# EAGLE design hackerstacker_mainboard (EAGLE 6.4)
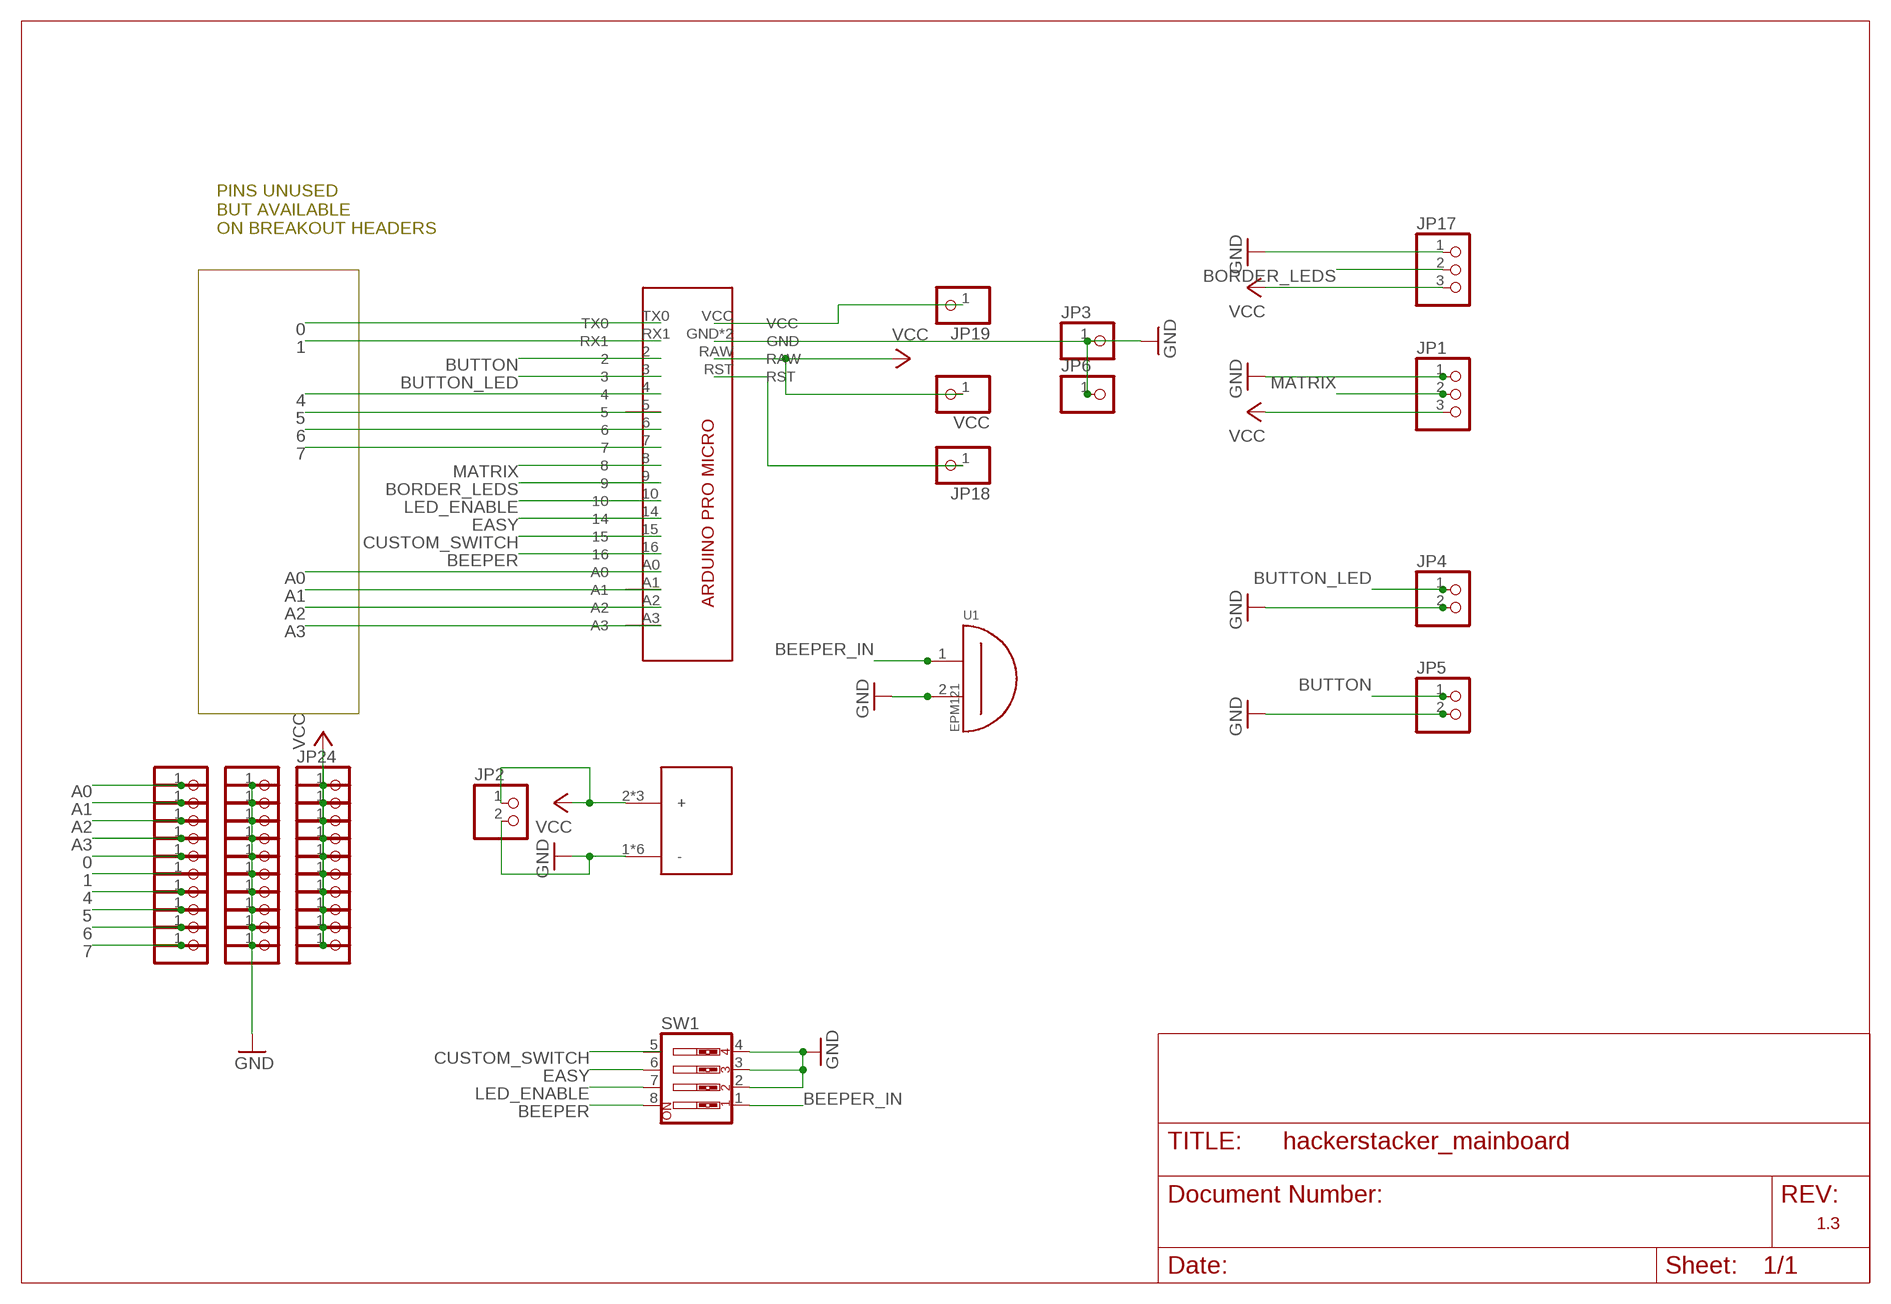
[diagram p0: schematic, sheet 1]

## Parts
JP1  PINHD-1X3  [1X03]
JP2  PINHD-1X2  [1X02]
JP3  PINHD-1X1CB  [1X01-CLEANBIG]
JP4  PINHD-1X2  [1X02]
JP5  PINHD-1X2  [1X02]
JP6  PINHD-1X1CB  [1X01-CLEANBIG]
JP7  PINHD-1X1CB  [1X01-CLEANBIG]
JP8  PINHD-1X1CB  [1X01-CLEANBIG]
JP9  PINHD-1X1CB  [1X01-CLEANBIG]
JP10  PINHD-1X1CB  [1X01-CLEANBIG]
JP11  PINHD-1X1CB  [1X01-CLEANBIG]
JP12  PINHD-1X1CB  [1X01-CLEANBIG]
JP13  PINHD-1X1CB  [1X01-CLEANBIG]
JP14  PINHD-1X1CB  [1X01-CLEANBIG]
JP15  PINHD-1X1CB  [1X01-CLEANBIG]
JP16  PINHD-1X1CB  [1X01-CLEANBIG]
JP17  PINHD-1X3  [1X03]
JP18  PINHD-1X1CB  [1X01-CLEANBIG]
JP19  PINHD-1X1CB  [1X01-CLEANBIG]
JP20  PINHD-1X1CB  [1X01-CLEANBIG]
JP21  PINHD-1X1CB  [1X01-CLEANBIG]
JP22  PINHD-1X1CB  [1X01-CLEANBIG]
JP23  PINHD-1X1CB  [1X01-CLEANBIG]
JP24  PINHD-1X1CB  [1X01-CLEANBIG]
JP25  PINHD-1X1CB  [1X01-CLEANBIG]
JP26  PINHD-1X1CB  [1X01-CLEANBIG]
JP27  PINHD-1X1CB  [1X01-CLEANBIG]
JP28  PINHD-1X1CB  [1X01-CLEANBIG]
JP29  PINHD-1X1CB  [1X01-CLEANBIG]
JP30  PINHD-1X1CB  [1X01-CLEANBIG]
JP31  PINHD-1X1CB  [1X01-CLEANBIG]
JP32  PINHD-1X1CB  [1X01-CLEANBIG]
JP33  PINHD-1X1CB  [1X01-CLEANBIG]
JP34  PINHD-1X1CB  [1X01-CLEANBIG]
JP35  PINHD-1X1CB  [1X01-CLEANBIG]
JP36  PINHD-1X1CB  [1X01-CLEANBIG]
JP37  PINHD-1X1CB  [1X01-CLEANBIG]
JP38  PINHD-1X1CB  [1X01-CLEANBIG]
JP39  PINHD-1X1CB  [1X01-CLEANBIG]
SW1  SW_DIP-4  [EDG-04]
U1  EPM121  [EPM121]
U$1  ARDUINO_PRO_MICRO  [APM_PAC]
U$3  2.1MMARDUINOPOERJACK  [POWERSUPPLY_DC-21MM]
VCC  PINHD-1X1CB  [1X01-CLEANBIG]

## Nets
0: JP11.1 U$1.TX0
1: JP12.1 U$1.RX1
4: JP13.1 U$1.4
5: JP37.1 U$1.5
6: JP38.1 U$1.6
7: JP39.1 U$1.7
A0: JP7.1 U$1.A0
A1: JP8.1 U$1.A1
A2: JP9.1 U$1.A2
A3: JP31.1 U$1.A3
BEEPER: SW1.8 U$1.16
BEEPER_IN: SW1.1 U1.1
BORDER_LEDS: JP17.2 U$1.9
BUTTON: JP5.1 U$1.2
BUTTON_LED: JP4.1 U$1.3
CUSTOM_SWITCH: SW1.5 U$1.15
EASY: SW1.6 U$1.14
GND: JP1.1 JP2.2 JP3.1 JP4.2 JP5.2 JP6.1 JP14.1 JP15.1 JP16.1 JP17.1 JP20.1 JP21.1 JP22.1 JP23.1 JP34.1 JP35.1 JP36.1 SW1.2 SW1.3 SW1.4 U1.2 U$1.GND U$1.GND2(GND) U$3.1(-) U$3.3(-) U$3.4(-) U$3.5(-) U$3.6(-) U$3.7(-)
LED_ENABLE: SW1.7 U$1.10
MATRIX: JP1.2 U$1.8
N$1: JP18.1 U$1.RST
N$15: JP19.1 U$1.VCC
VCC: JP1.3 JP2.1 JP10.1 JP17.3 JP24.1 JP25.1 JP26.1 JP27.1 JP28.1 JP29.1 JP30.1 JP32.1 JP33.1 U$1.RAW U$3.2(+) U$3.8(+) U$3.9(+) VCC.1

## Notes on the sheet
- PINS UNUSED 
  BUT AVAILABLE
  ON BREAKOUT HEADERS
- 1.3

## Library data of the parts
JP1 JP17 = pinhead:PINHD-1X3: PIN HEADER
JP2 JP4 JP5 = pinhead:PINHD-1X2: PIN HEADER
JP3 JP6-JP16 JP18-JP39 VCC = adafruit:PINHD-1X1: Pin header 1x1 for 0.1" spacing With round pins
SW1 = special:SW_DIP-4: DIP SWITCH
U1 = mp_modules:EPM121: EPM121 Piezo
U$1 = hackerstacker:ARDUINO_PRO_MICRO
U$3 = hackerstacker:2.1MMARDUINOPOERJACK

## Board
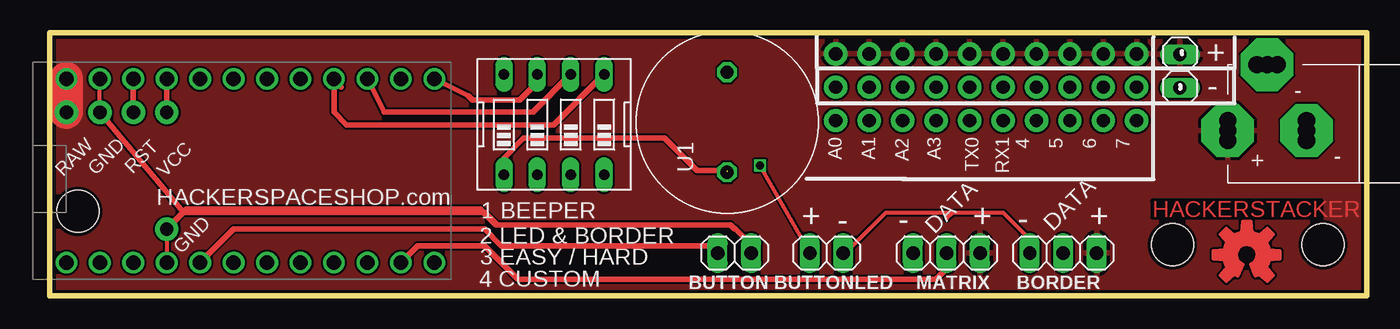
[diagram p1: board, top side]
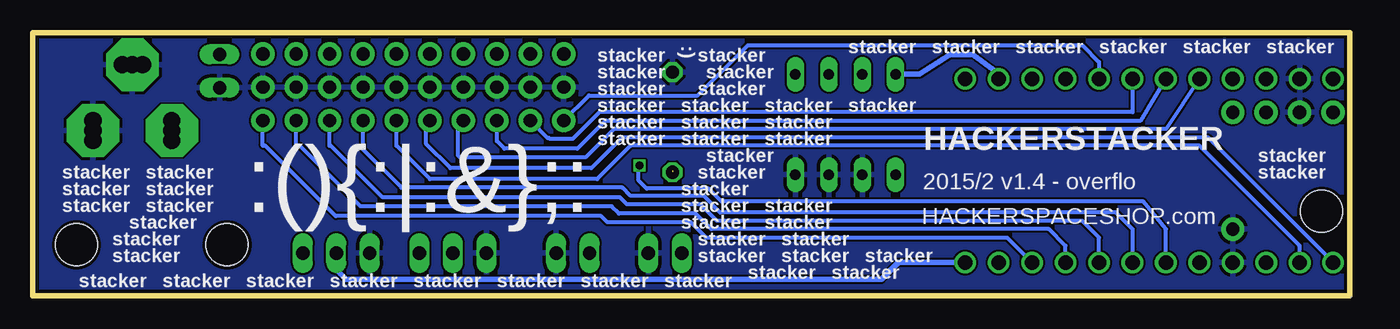
[diagram p2: board, bottom side, seen from below]

Size 100 x 20 mm. Coordinates in mm from the lower left corner, seen from the top.
Outline: 0,20 0,0 100,0 100,20 0,20
Copper layers (1*16): Top 0.035mm / dielectric 1.5mm / Bottom 0.035mm
Design rules "Fusion_eagle_rule_v1.1": minimum track width 6mil, minimum drill 12mil, track to track 6mil, track to pad 6mil, pad to pad 6mil, via to via 6mil, smd to smd 0mil, copper to edge 10mil, drill to drill 10mil, minimum pad ring 10mil, minimum via ring 6mil, stop-mask expansion 2mil, vias tented up to drill 100mil, thermal gap 10mil
Holes 3.2 mm at 96.69,3.89 2.14,6.43 85.26,3.89

### Footprints (pad centres in the part's own frame; a part is rotated, then mirrored left to right if it is on the bottom)
1X03 = drill 1.016 long: 1 -2.54,0; 2 0,0; 3 2.54,0
1X02 = drill 1.016 long: 1 -1.27,0; 2 1.27,0
1X01-CLEANBIG = drill 1.016 pad 1.778: 1 0,0
EDG-04 = drill 0.813 long: 1 -3.81,-3.81; 2 -1.27,-3.81; 3 1.27,-3.81; 4 3.81,-3.81; 5 3.81,3.81; 6 1.27,3.81; 7 -1.27,3.81; 8 -3.81,3.81
EPM121 = drill 1 octagon: 1 -3.8,0; 2 3.8,0
APM_PAC = drill 1.1: 2 -7.62,-1.27; 3 -7.62,-3.81; 4 -7.62,-6.35; 5 -7.62,-8.89; 6 -7.62,-11.43; 7 -7.62,-13.97; 8 -7.62,-16.51; 9 -7.62,-19.05; 10 6.35,-19.05; 14 6.35,-13.97; 15 6.35,-11.43; 16 6.35,-16.51; A0 6.35,-8.89; A1 6.35,-6.35; A2 6.35,-3.81; A3 6.35,-1.27; GND 6.35,6.35; GND2 -7.62,1.27; GNDRSTNC -7.62,3.81; RAW 6.35,8.89; RST 6.35,3.81; RX1 -7.62,6.35; TX0 -7.62,8.89; VCC 6.35,1.27
POWERSUPPLY_DC-21MM = drill 1.3 pad 4 octagon: 1 -5.08,-3.353; 2 -0.076,-6.35; 3 -0.076,-0.356 | drill 1.3: 4 -5.08,-4.115; 5 -5.08,-2.591; 6 -0.838,-0.356; 7 0.686,-0.356; 8 -0.838,-6.35; 9 0.686,-6.35

### Placement (x,y rotation side)
JP1  68.11,3.27 0 top
JP2  85.82,17.1 270 top
JP3  3.81,13.97 0 top
JP4  59,3.27 0 top
JP5  52,3.27 0 top
JP6  8.89,5.08 0 top
JP7  59.69,13.34 0 top
JP8  62.23,13.34 0 top
JP9  64.77,13.34 0 top
JP10  77.47,18.41 0 top
JP11  69.85,13.34 0 top
JP12  72.39,13.34 0 top
JP13  74.93,13.34 0 top
JP14  59.69,15.88 0 top
JP15  62.23,15.88 0 top
JP16  64.77,15.88 0 top
JP17  76.97,3.27 0 top
JP18  6.35,13.97 0 top
JP19  8.89,13.97 0 top
JP20  67.31,15.88 0 top
JP21  69.85,15.88 0 top
JP22  72.39,15.88 0 top
JP23  74.93,15.88 0 top
JP24  59.69,18.41 0 top
JP25  62.23,18.41 0 top
JP26  64.77,18.41 0 top
JP27  67.31,18.41 0 top
JP28  69.85,18.41 0 top
JP29  72.39,18.41 0 top
JP30  74.93,18.41 0 top
JP31  67.31,13.34 0 top
JP32  80.01,18.41 0 top
JP33  82.55,18.41 0 top
JP34  77.47,15.88 0 top
JP35  80.01,15.88 0 top
JP36  82.55,15.88 0 top
JP37  77.47,13.34 0 top
JP38  80.01,13.34 0 top
JP39  82.55,13.34 0 top
SW1  38.3,13.04 0 top
U1  51.44,13.21 90 top
U$1  10.16,10.16 90 top
U$3  95.8,12.5 270 top
U$4  [OSHWLOGO_TOP_0.2]  90.9,3.13 0 top
VCC  1.27,13.97 0 top

### Tracks (layer width: path | path; a pad name or v marks a point on that pad's centre or on a via)
0
  Bottom 0.305: U$1.TX0 10.79,12.06 55.24,12.06 57.59,9.72 68.3,9.72 70.13,11.54 70.13,13.06 JP11.1
1
  Bottom 0.305: U$1.RX1 3.81,3.81 11.43,11.43 54.61,11.43 57.15,8.89 69.85,8.89 72.39,11.43 JP12.1
4
  Bottom 0.305: U$1.4 16.51,5.08 17.78,6.35 47.82,6.35 49.1,7.63 49.11,7.62 54.61,7.62 55.23,8.24 72.02,8.24 74.93,11.15 JP13.1
5
  Bottom 0.305: U$1.5 19.05,4.45 20.32,5.71 48.06,5.71 49.3,6.96 54.89,6.96 55.42,7.49 73.44,7.49 77.38,11.43 77.47,11.43 JP37.1
6
  Bottom 0.305: U$1.6 21.59,3.81 22.86,5.08 48.5,5.08 49.7,6.27 55.5,6.27 56.05,6.82 75.12,6.82 79.73,11.43 80.01,11.43 JP38.1
7
  Bottom 0.305: U$1.7 26.04,4.45 48.9,4.45 49.53,5.08 49.53,5.09 50.04,5.6 56.38,5.6 56.84,6.07 77.01,6.07 82.37,11.43 82.55,11.43 JP39.1
A0
  Bottom 0.305: JP7.1 57.78,15.24 49.53,15.24 45.72,19.05 20.32,19.05 19.05,17.78 U$1.A0
A1
  Bottom 0.305: U$1.A1 16.51,13.97 56.98,13.97 59,11.95 60.77,11.95 60.83,12.01 60.91,12.01 JP8.1
A2
  Bottom 0.305: U$1.A2 15.88,13.34 56.52,13.34 58.65,11.2 64.2,11.2 64.77,11.77 JP9.1
A3
  Bottom 0.305: U$1.A3 13.97,12.7 55.88,12.7 58.05,10.53 67.58,10.53 67.7,10.65 67.7,12.76 67.31,13.16 JP31.1
BEEPER
  Bottom 0.406: SW1.8 32.69,16.84 30.38,18.35 28.61,18.35 26.17,16.51 U$1.16
BEEPER_IN  (1 unrouted)
  Top 0.406: SW1.1 34.49,10.49 36,12 46.7,12 49.17,9.53 51.44,9.53
BORDER_LEDS
  Bottom 0.406: U$1.9 34.29,2.54 35.56,1.27 76.2,1.27 77.47,2.54 77.47,2.77 JP17.2
BUTTON
  Top 0.406: U$1.2 13.97,5.08 33.02,5.08 34.29,3.81 50.8,3.81 50.8,3.34 JP5.1
BUTTON_LED  (via drill 0.6)
  Top 0.305: v53.95,9.92 JP4.1
  Bottom 0.305: U$1.3 13.97,5.08 15.67,7.18 47.71,7.18 48.69,8.17 53.4,8.17 54.01,8.78 54.01,9.86 v53.95,9.92
CUSTOM_SWITCH
  Top 0.406: 22.13,15.87 U$1.15 21.59,13.97 22.56,13 38.27,13 SW1.5
EASY
  Top 0.406: U$1.14 25.4,13.97 36.7,13.97 SW1.6 38.1,15.38
GND
  Top 0.305: JP3.1 U$1.GND | JP6.1 U$1.GND2 | 68.11,5.88 68.58,6.35 | 68.58,6.35 72.39,6.35 74.93,3.81 74.93,3.77 JP17.1 | JP4.2 60.42,3.27 63.5,6.35 68.58,6.35
  Top 0.406: 60,3.54 JP4.2 | JP5.2 53.27,3.88 52.07,5.08 52.02,5.08 51.7,5.4 33.97,5.4 | 33.97,5.4 33.9,5.4 32.7,6.6 10.41,6.6 JP6.1 | 33.97,5.4 33.02,6.35 10.16,6.35 JP3.1
  pour Bottom: 0,20 99.4,20 99.4,0 0,0
LED_ENABLE
  Top 0.406: U$1.10 31.76,15.24 32.1,14.9 35.7,14.9 36.9,16.1 36.9,16.71 SW1.7
MATRIX
  Top 0.406: U$1.8 27.94,3.81 33.02,3.81 35.56,1.27 67.31,1.27 68.58,2.54 68.58,2.8 JP1.2
N$1
  Top 0.406: JP18.1 U$1.RST
N$15
  Top 0.406: JP19.1 U$1.VCC
VCC
  Top 2.54: U$1.RAW VCC.1
  pour Top: 0,20 99.6,19.9 99.6,-0.1 0,0

### Text on the board
Top: HACKERSTACKER
tPlace: + | - | - | A0 | A1 | A2 | A3 | TX0 | RX1 | 4 | 5 | 6 | 7 | + | - | RAW | GND | RST | VCC | HACKERSPACESHOP.com | 1 BEEPER | + | - | - | DATA | + | - | DATA | + | 2 LED & BORDER | GND | 3 EASY / HARD | 4 CUSTOM | BUTTON | BUTTONLED | MATRIX | BORDER
bPlace: :) | stacker | stacker | stacker | stacker | stacker | stacker | stacker | stacker | stacker | stacker | stacker | stacker | stacker | stacker | stacker | stacker | stacker | stacker | stacker | HACKERSTACKER | stacker | stacker | stacker | stacker | stacker | stacker | stacker | stacker | stacker | 2015/2 v1.4 - overflo | stacker | stacker | stacker | stacker | stacker | :(){:|:&};: | stacker | stacker | HACKERSPACESHOP.com | stacker | stacker | stacker | stacker | stacker | stacker | stacker | stacker | stacker | stacker | stacker | stacker | stacker | stacker | stacker | stacker | stacker | stacker | stacker | stacker
tStop: HACKERSTACKER